# Altium schematic sheet FlexEMG_v0r0_RADIO.SchDoc
size A3
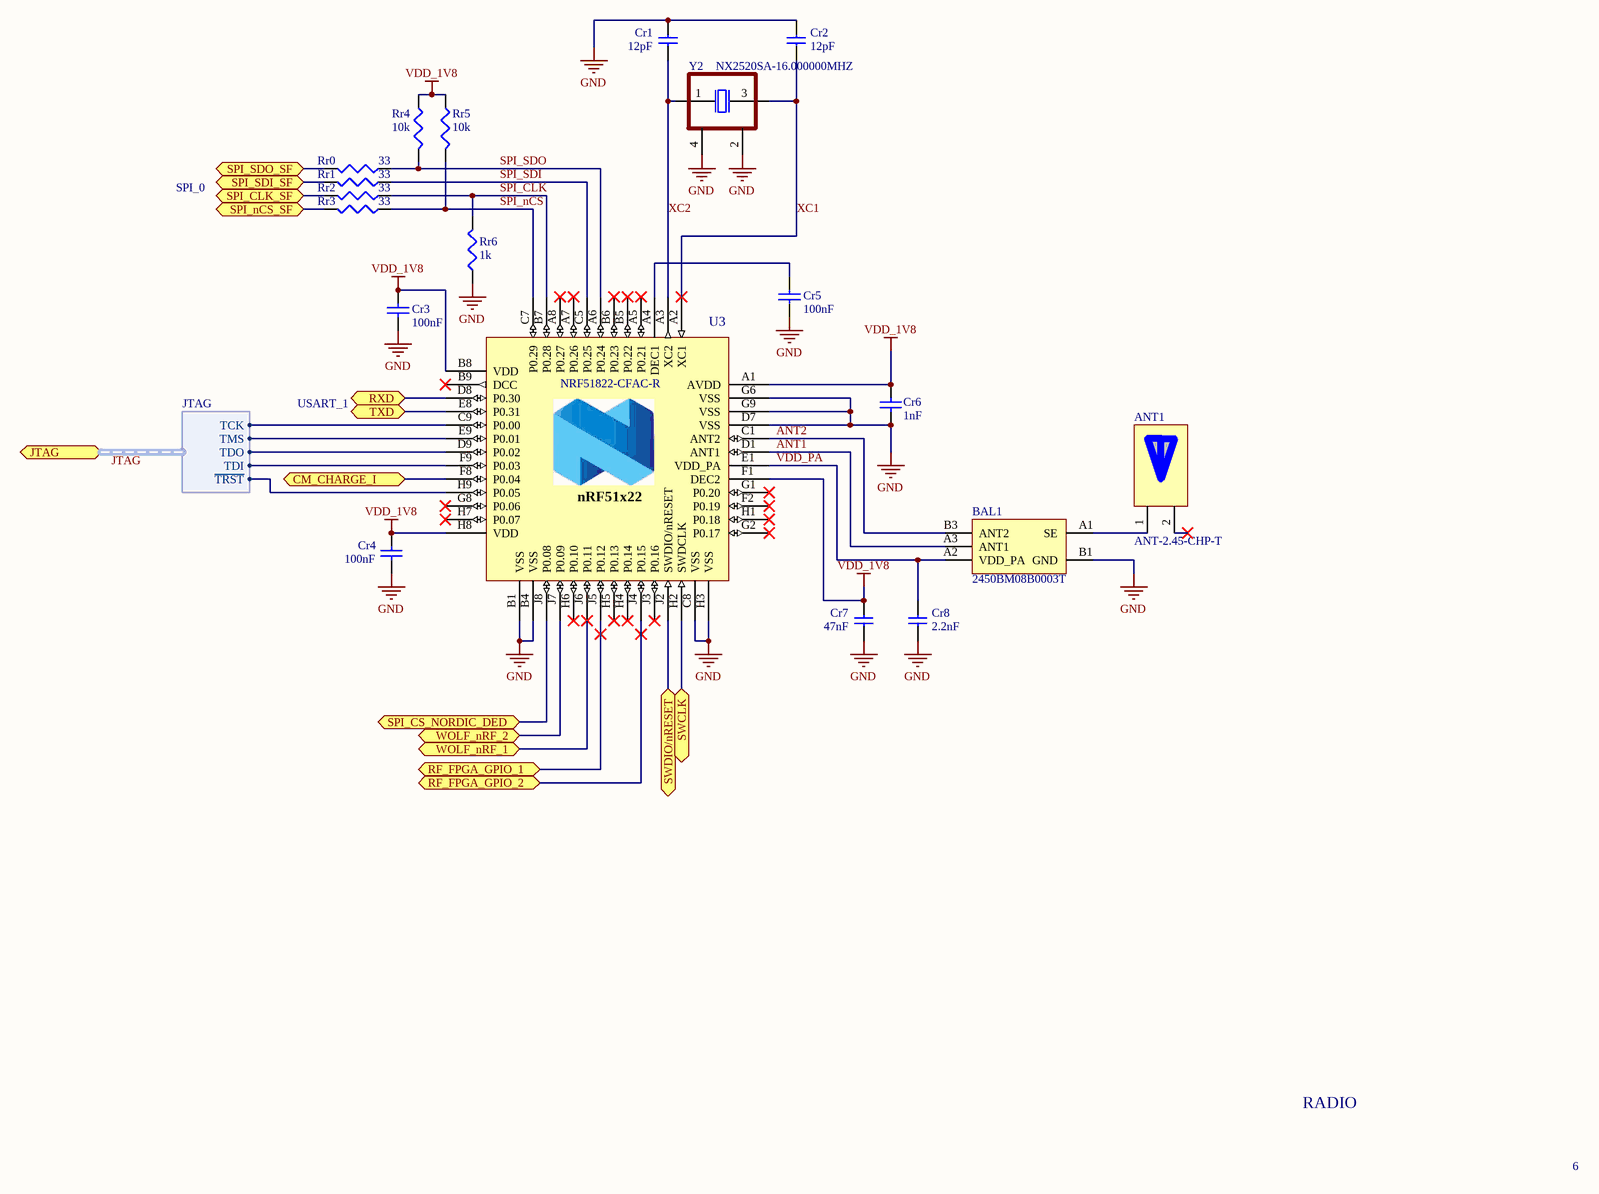
[diagram p0: FlexEMG_v0r0_RADIO.SchDoc]

## Parts
ANT1  ANT-2.45-CHP-T  [ANTENNACHIP]
BAL1  2450BM08B0003T  [BALUN_PACKAGE]
Cr1  value 12pF  [c0402-Murata-GR]  (hidden comment: GRM1555C1H120FA01D)
Cr2  value 12pF  [c0402-Murata-GR]  (hidden comment: GRM1555C1H120FA01D)
Cr3  value 100nF  [0402_ss]  (hidden comment: GRM033R6YA104KE14D)
Cr4  value 100nF  [c0402-Murata-GR]  (hidden comment: GRM155R61H104KE19D)
Cr5  value 100nF  [0201]  (hidden comment: GRM033R6YA104KE14D)
Cr6  value 1nF  [c0402-Murata-GR]  (hidden comment: GRM155R61H102KA01D)
Cr7  value 47nF  [c0402-Murata-GR]  (hidden comment: GRM155R71E473KA88D)
Cr8  value 2.2nF  [c0402-Murata-GR]
Rr0  value 33  [0201]  (hidden comment: ERJ-PA2J330X)
Rr1  value 33  [0201]  (hidden comment: ERJ-PA2J330X)
Rr2  value 33  [0201]  (hidden comment: ERJ-PA2J330X)
Rr3  value 33  [0201]  (hidden comment: ERJ-PA2J330X)
Rr4  value 10k  [0201]  (hidden comment: ERJ-2RKF1002X)
Rr5  value 10k  [0402_p]  (hidden comment: ERJ-2RKF1002X)
Rr6  value 1k  [0201]  (hidden comment: ERJ-2RKF1001X)
U3  NRF51822-CFAC-R  [BGA_NORDIC]
Y2  NX2520SA-16.000000MHZ  [XOSC_4PIN]

## Ports
CM_CHARGE_I (bidir), JTAG (harness JTAG), RF_FPGA_GPIO_1 (bidir), RF_FPGA_GPIO_2 (bidir), RXD (bidir), SPI_CLK_SF (bidir), SPI_CS_NORDIC_DED (bidir), SPI_nCS_SF (bidir), SPI_SDI_SF (bidir), SPI_SDO_SF (bidir), SWCLK (bidir), SWDIO/nRESET (bidir), TXD (bidir), WOLF_nRF_1 (bidir), WOLF_nRF_2 (bidir)

## Harnesses
JTAG: ~{TRST}, TCK, TMS, TDI, TDO

## Nets
GND: BAL1.B1(GND) Cr1.2 Cr2.2 Cr3.1 Cr4.1 Cr5.1 Cr6.2 Cr7.1 Cr8.1 Rr6.1 U3.B1(VSS) U3.B4(VSS) U3.C8(VSS) U3.D7(VSS) U3.G6(VSS) U3.G9(VSS) U3.H3(VSS) Y2.2(GND) Y2.4(GND)
VDD_1V8: Cr3.2 Cr4.2 Cr6.1 Cr7.2 Rr4.1 Rr5.1 U3.A1(AVDD) U3.B8(VDD) U3.F1(DEC2) U3.H8(VDD)
ANT1: BAL1.A3(ANT1) U3.D1(ANT1)
ANT2: BAL1.B3(ANT2) U3.C1(ANT2)
CM_CHARGE_I: U3.F8(P0.04) ; port CM_CHARGE_I
JTAG.~{TRST}: U3.H9(P0.05) ; port JTAG.~{TRST}
JTAG.TCK: U3.C9(P0.00) ; port JTAG.TCK
JTAG.TDI: U3.F9(P0.03) ; port JTAG.TDI
JTAG.TDO: U3.D9(P0.02) ; port JTAG.TDO
JTAG.TMS: U3.E9(P0.01) ; port JTAG.TMS
RF_FPGA_GPIO_1: U3.J5(P0.12) ; port RF_FPGA_GPIO_1
RF_FPGA_GPIO_2: U3.J4(P0.15) ; port RF_FPGA_GPIO_2
RXD: U3.D8(P0.30) ; port RXD
SPI_CLK: Rr2.1 Rr6.2 U3.B7(P0.28)
SPI_CLK_SF: Rr2.2 ; port SPI_CLK_SF
SPI_CS_NORDIC_DED: U3.J8(P0.08) ; port SPI_CS_NORDIC_DED
SPI_nCS: Rr3.1 Rr5.2 U3.C7(P0.29)
SPI_nCS_SF: Rr3.2 ; port SPI_nCS_SF
SPI_SDI: Rr1.1 U3.C5(P0.25)
SPI_SDI_SF: Rr1.2 ; port SPI_SDI_SF
SPI_SDO: Rr0.1 Rr4.2 U3.A6(P0.24)
SPI_SDO_SF: Rr0.2 ; port SPI_SDO_SF
SWCLK: U3.H2(SWDCLK) ; port SWCLK
SWDIO/nRESET: U3.J2(SWDIO/nRESET) ; port SWDIO/nRESET
TXD: U3.E8(P0.31) ; port TXD
VDD_PA: BAL1.A2(VDD_PA) Cr8.2 U3.E1(VDD_PA)
WOLF_nRF_1: U3.J6(P0.11) ; port WOLF_nRF_1
WOLF_nRF_2: U3.J7(P0.09) ; port WOLF_nRF_2
XC1: Cr2.1 U3.A2(XC1) Y2.3(out)
XC2: Cr1.1 U3.A3(XC2) Y2.1(inp)
NetANT1_1: ANT1.1(IN) BAL1.A1(SE)
NetCr5_2: Cr5.2 U3.A4(DEC1)

Not connected (* = marked no-connect by the designer): ANT1 2(NC)*; U3 A5(P0.21)* A7(P0.26)* A8(P0.27)* B5(P0.22)* B6(P0.23)* B9(DCC)* F2(P0.19)* G1(P0.20)* G2(P0.17)* G8(P0.06)* H1(P0.18)* H4(P0.14)* H5(P0.13)* H6(P0.10)* H7(P0.07)* J3(P0.16)*

## Buses and harness runs
harness JTAG = port JTAG

## Notes on the sheet
- SPI_0
- USART_1
- RADIO
- 6
- (in symbol nRF51822) nRF51x22

## Library data of the parts
ANT1 = Linx ANT-2.45-CHP-x: ANT 2.4GHZ 802.11 BLUETOOTH SMD; Manufacturer: Linx; Supplier PN: ANT-2.45-CHPCT-ND; Supplier: Digikey; Manufacturer PN: ANT-2.45-CHP-T
BAL1 = BAL_NRF02D3: BALUN 2.4GHZ; Manufacturer: Johnson; Supplier PN: 712-1582-1-ND; Supplier: Digikey; Manufacturer PN: 2450BM08B0003T
Cr1 Cr2 = CAP_0402: CAP CER 12PF 50V NP0 0402; Manufacturer: Murata; Supplier: Digikey; Manufacturer PN: GRM1555C1H120FA01D; Supplier PN: 490-6196-1-ND
Cr3 Cr5 = Cap: CAP CER 0.1UF 16V X7S 0201; Manufacturer: Murata; Note: 35V 10% X5R; Supplier PN: 490-10430-1-ND; Supplier: Digikey; Manufacturer PN: GRM033R6YA104KE14D
Cr4 = Cap: CAP CER 0.1UF 50V X5R 0402; Manufacturer: Murata; Supplier: Digikey; Manufacturer PN: GRM155R61H104KE19D; Supplier PN: 490-11917-1-ND
Cr6 = Cap: CAP CER 1000PF 50V X5R 0402; Manufacturer: Murata; Supplier: Digikey; Supplier PN: 490-6316-1-ND; Manufacturer PN: GRM155R61H102KA01D
Cr7 = CAP_0402: CAP CER 0.047UF 25V X7R 0402 10%; Manufacturer: Murata; Supplier: Digikey; Manufacturer PN: GRM155R71E473KA88D; Supplier PN: 490-3254-1-ND
Cr8 = CAP_0402: CAP CER 2200PF 50V X7R 0402; Manufacturer: Murata; Manufacturer PN: GRM155R71H222JA01J; Supplier: Digikey; Supplier PN: 490-6359-1-ND
Rr0-Rr3 = Resistor: RES SMD 33 OHM 1% 1/10W 0402; Manufacturer: Panasonic; Power: 1/5W; Manufacturer PN: ERJ-PA2J330X; Supplier: Digikey; Supplier P/N: P17184CT-ND; Package: 0402
Rr4 Rr5 = Resistor: RES SMD 10K OHM 1% 1/10W 0402; Manufacturer: Panasonic; Manufacturer PN: ERJ-2RKF1002X; Supplier: Digikey; Supplier P/N: P10.0KLCT-ND; Power: 1/10W; Package: 0402
Rr6 = Resistor: RES SMD 1K OHM 1% 1/10W 0402; Manufacturer: Panasonic; Manufacturer PN: ERJ-2RKF1001X; Supplier: Digikey; Supplier P/N: P1.00KLCT-ND; Power: 1/10W; Package: 0402
U3 = nRF51822: IC SOC 2.4GHZ MULTIPROTO 62WLCS; Manufacturer: Nordic; Manufacturer PN: NRF51822-CFAC-R; Supplier: Digikey; Supplier PN: 1490-1041-1-ND
Y2 = XOSC: CRYSTAL 16.0000MHZ 10PF SMD; Manufacturer: NDK; Supplier PN: 644-1059-1-ND; Supplier: Digikey; Manufacturer PN: NX2520SA-16.000000MHZ